# Altium schematic sheet PDMC-S03-V00-ChannelOutput.SchDoc: Channel Output and Current Sensing
size A3; DrawnBy: Zoe Goodward; Organization: QUT Motorsport; Address1: O-120, Gardens Point; Address2: 2 George Street; Address3: Brisbane, QLD 4000; Address4: Australia; DocumentNumber: 3; Revision: 01; SheetNumber: 3; SheetTotal: 6; Version: 01; Project: Power Distribution Module Card; PageSetup: Record=PageOptions|CenterHorizontal=True|CenterVertical=True|PrintScale=0.97|XCorrection=1.00|YCorrection=1.00|PrintKind=0|BorderSize=5000000|LeftOffset=0|BottomOffset=0|Orientation=2|PaperLength=1000|PaperWidth=1000|Scale=100|PaperSource=7|PrintQuality=-4|MediaType=1|DitherType=10|PaperKind=A4|PrintScaleMode=1
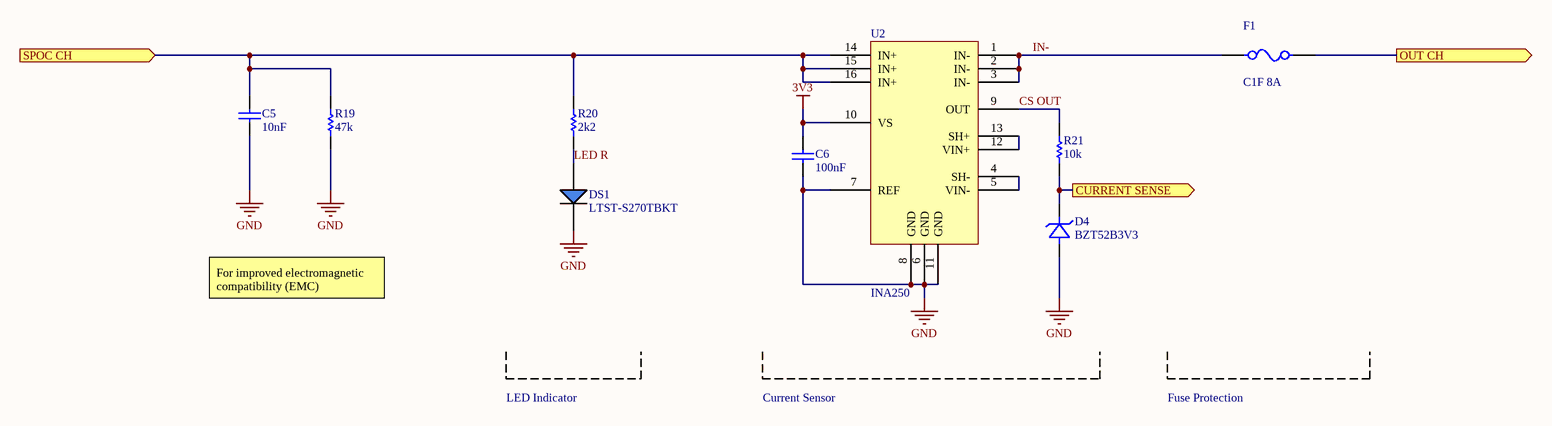
[diagram p0: PDMC-S03-V00-ChannelOutput.SchDoc]

## Parts
C5  10nF  [Cap_Ceramic_0603]
C6  100nF  [Cap_Ceramic_0603]
D4  BZT52B3V3  [SOD123]
DS1  LTST-S270TBKT  [LTST-S270TBKT]
F1  C1F 8A  [FUSE_1206]
R19  47k  [Res_ThinFilm_0603]
R20  2k2  [Res_ThinFilm_0603]
R21  10k  [Res_ThinFilm_0603]
U2  INA250  [TSSOP-16N]

## Ports
CURRENT SENSE (out), OUT CH (out), SPOC CH (in)

## Nets
3V3: C6.2 U2.10(VS)
GND: C5.1 C6.1 D4.A(Anode) DS1.K R19.1 U2.6(GND) U2.7(REF) U2.8(GND) U2.11(GND)
CS OUT: R21.2 U2.9(OUT)
CURRENT SENSE: D4.K(Cathode) R21.1 ; port CURRENT SENSE
IN-: F1.1 U2.1(IN-) U2.2(IN-) U2.3(IN-)
LED R: DS1.A R20.1
OUT CH: F1.2 ; port OUT CH
SPOC CH: C5.2 R19.2 R20.2 U2.14(IN+) U2.15(IN+) U2.16(IN+) ; port SPOC CH
NetU2_4: U2.4(SH-) U2.5(VIN-)
NetU2_12: U2.12(VIN+) U2.13(SH+)

## Notes on the sheet
- For improved electromagnetic compatibility (EMC)
- LED Indicator
- Current Sensor
- Fuse Protection
- Revision History:
- Sheet Title:
- Rev
- Date
- Description
- Project:
- Size:
- Drawn By:
- A3
- Number:
- Revision:
- Sheet
- Version:
- of
- QUT Motorsport
- O-120, Gardens Point
- 2 George Street
- Brisbane, QLD 4000
- Australia
- Print Date:
- Print Time:
- File Name:

## Library data of the parts
C5 = 10nF 25V 5% X7R 0603: Capacitor, Ceramic, SMD, 10nF, 25V, 5%, X7R, 0603
C6 = 100nF 50V 5% X7R 0603: Capacitor, Ceramic, SMD, 100nF, 50V, 5%, X7R, 0603
D4 = BZT52B3V3: Diode, SMD, Zener, 3.3V, 2%, 410mW, SOD-123; ComponentLink1Description: Datasheet; ComponentLink1URL: https://www.vishay.com/docs/85760/bzt52.pdf; ComponentLink2Description: Digikey; ComponentLink2URL: https://www.digikey.com/product-detail/en/vishay-semiconductor-diodes-division/BZT52B3V3-E3-08/112-BZT52B3V3-E3-08CT-ND/8564806
DS1 = LTST-S270TBKT: Blue 465~475nm 0603 Light Emitting Diodes (LED) RoHS
F1 = C1F 8: 8A 125V AC 63V DC Fuse Board Mount (Cartridge Style Excluded) Surface Mount 1206 (3216 Metric); ComponentLink1Description: Datasheet; ComponentLink1URL: https://belfuse.com/resources/datasheets/circuitprotection/ds-cp-c1f-series.pdf; ComponentLink2Description: Digikey; ComponentLink2URL: https://www.digikey.com.au/product-detail/en/bel-fuse-inc/C1F-8/507-1889-1-ND/4968171
R19 = 47k 5% 0603: Resistor, SMD, 47k, 0.1W, 5%, 0603
R20 = 2k2 5% 0603: Resistor, SMD, 2k2, 0.1W, 5%, 0603
R21 = 10k 5% 0603: Resistor, SMD, 10k, 0.1W, 5%, 0603
U2 = INA250: INA250 36-V, Low- or High-Side, Bidirectional, Zero-Drift Current-Shunt Monitor with Precision Integrated Shunt Resistor; ComponentLink1Description: Datasheet; ComponentLink1URL: https://www.ti.com/lit/ds/symlink/ina250.pdf?HQS=TI-null-null-digikeymode-df-pf-null-wwe&ts=1595428770724; ComponentLink2Description: Digikey - A4; ComponentLink2URL: https://www.digikey.com.au/product-detail/en/texas-instruments/INA250A4PWR/296-43804-1-ND/5870052